# Altium project B101AA.PrjPcb (part 2 of 2)

## Sheet Shut Down Signal Control.SchDoc: Shut Down Signal Control
size 292 x 193 mm; SheetNumber: 7; SheetTotal: 15
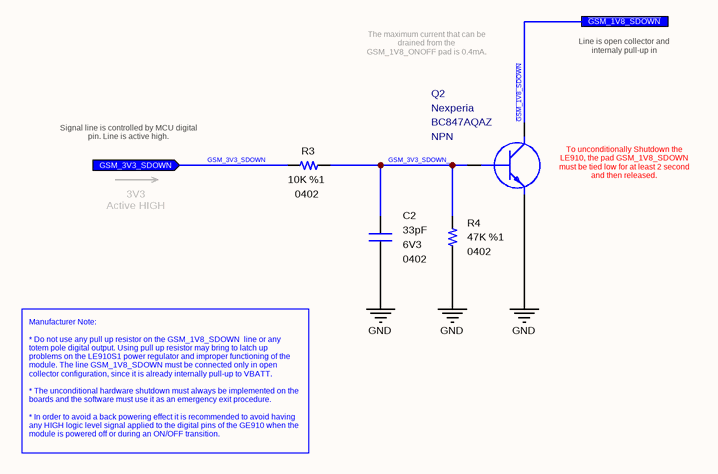
[diagram p13: Shut Down Signal Control.SchDoc]

### Parts
C2  value 33pF  Case: 0402  Voltage: 6V3  [CAPACITOR_0402]
Q2  Polarity: NPN  Manufacturer Part Number: BC847AQAZ  Manufacturer Name: Nexperia  [SOT1215]
R3  value 10K  Case: 0402  Tolerance: %1  [RESISTOR_0402]
R4  value 47K  Case: 0402  Tolerance: %1  [RESISTOR_0402]

### Ports
GSM_3V3_SDOWN (in), ~{GSM_1V8_SDOWN}

### Nets
GND: C2.1 Q2.2(E) R4.1
~{GSM_1V8_SDOWN}: Q2.3(C) ; port ~{GSM_1V8_SDOWN}
GSM_3V3_SDOWN: R3.2 ; port GSM_3V3_SDOWN
GSM_3V3_SDOWN_: C2.2 Q2.1(B) R3.1 R4.2

### Notes on the sheet
- The maximum current that can be drained from the GSM_1V8_ONOFF pad is 0.4mA.
- Line is open collector and internaly pull-up in LE910S1.
- Signal line is controlled by MCU digital pin. Line is active high.
- (near Q2) To unconditionally Shutdown the LE910, the pad GSM_1V8_SDOWN must be tied low for at least 2 second and then released.
- 3V3
  Active HIGH
- Manufacturer Note:
  * Do not use any pull up resistor on the GSM_1V8_SDOWN  line or any totem pole digital output. Using pull up resistor may bring to latch up problems on the LE910S1 power regulator and improper functioning of the module. The line GSM_1V8_SDOWN must be connected only in open collector configuration, since it is already internally pull-up to VBATT.
  * The unconditional hardware shutdown must always be implemented on the boards and the software must use it as an emergency exit procedure.
  * In order to avoid a back powering effect it is recommended to avoid having any HIGH logic level signal applied to the digital pins of the GE910 when the module is powered off or during an ON/OFF transition.
- © 2021 All rights reserved.
  This document may not, in whole or in part, be copied, photocopied, reproduced, translated or converted to any electronic or machine readable from without prior written permission of Mehmet Günce Akkoyun.
  Engineer contact : akkoyun@me.com
- Property of
- Engineer :
- Date :
- Size :
- A4
- Time :
- Project :
- Page :
- /
- Customer :
- Product ID :
- Module ID :
- Version :
- File :
- Revision :

### Library data of the parts
C2 = 33pF [0402-6V3]: Capacitor - 33pF [0402] (Ceramic); Manufacturer Part Number: C0402C330J9RACAUTO; Manufacturer Name: Kemet; Dielectric: X7R; Tolerance: 10%; Height: 0.5mm; Maximum Operating Temperature: +125; Minimum Operating Temperature: -55; ROHS: Yes; ComponentLink1Description: DataSheet; ComponentLink1URL: https://api.kemet.com/component-edge/download/datasheet/C0402C330J9RACAUTO.pdf; ComponentLink2Description: Mouser; ComponentLink2URL: https://www.mouser.com/Search/Refine.aspx?Keyword=80-C0402C330J9RAUTO
Q2 = BC847: Bipolar NPN Transistors; Case: DFN-1010D-3
R3 = 10K: Thick Film Resistors - SMD 1/16 W 10 Kohms 1%; Manufacturer Name: Vishay; Manufacturer Part Number: CRCW040210K0FKED; Height: 0.4mm; ComponentLink1Description: DataSheet; ComponentLink1URL: https://www.mouser.com.tr/datasheet/2/427/dcrcwe3-1762152.pdf; ComponentLink2Description: Mouser; ComponentLink2URL: https://www.mouser.com.tr/ProductDetail/Vishay-Dale/CRCW040210K0FKED?qs=sGAEpiMZZMu61qfTUdNhG2DpbjADlD3GcalbOv9utCY%3D
R4 = 47K: Thick Film Resistors - SMD 1/16 W 47 Kohms 1%; Manufacturer Name: Vishay; Manufacturer Part Number: CRCW040247K0FKED; ComponentLink1URL: https://www.mouser.com.tr/datasheet/2/427/dcrcwe3-1762152.pdf; ComponentLink1Description: DataSheet; Height: 0.4mm; ComponentLink2Description: Mouser; ComponentLink2URL: https://www.mouser.com.tr/ProductDetail/Vishay-Dale/CRCW040247K0FKED?qs=sGAEpiMZZMu61qfTUdNhG2DpbjADlD3GL%252B3h1elTxqU%3D

## Sheet GNSS EN Signal Control.SchDoc: On / Off Signal Control
size 292 x 193 mm; SheetNumber: 8; SheetTotal: 15
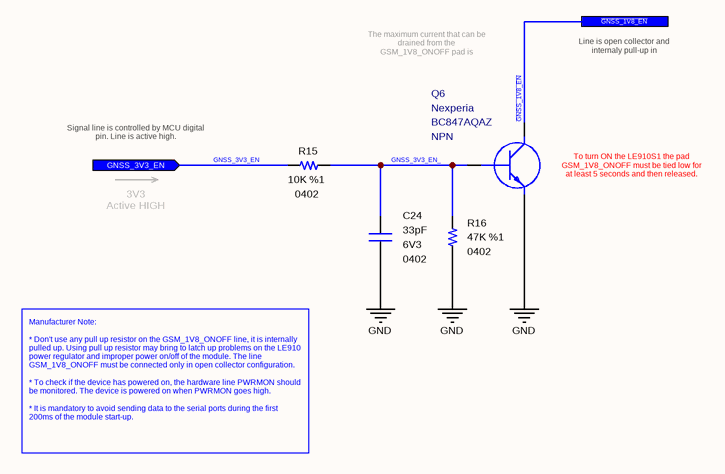
[diagram p14: GNSS EN Signal Control.SchDoc]

### Parts
C24  value 33pF  Case: 0402  Voltage: 6V3  [CAPACITOR_0402]
Q6  Polarity: NPN  Manufacturer Part Number: BC847AQAZ  Manufacturer Name: Nexperia  [SOT1215]
R15  value 10K  Case: 0402  Tolerance: %1  [RESISTOR_0402]
R16  value 47K  Case: 0402  Tolerance: %1  [RESISTOR_0402]

### Ports
GNSS_3V3_EN (in), ~{GNSS_1V8_EN}

### Nets
GND: C24.1 Q6.2(E) R16.1
~{GNSS_1V8_EN}: Q6.3(C) ; port ~{GNSS_1V8_EN}
GNSS_3V3_EN: R15.2 ; port GNSS_3V3_EN
GNSS_3V3_EN_: C24.2 Q6.1(B) R15.1 R16.2

### Notes on the sheet
- The maximum current that can be drained from the GSM_1V8_ONOFF pad is 0.12mA.
- Line is open collector and internaly pull-up in LE910S1.
- Signal line is controlled by MCU digital pin. Line is active high.
- (near Q6) To turn ON the LE910S1 the pad GSM_1V8_ONOFF must be tied low for at least 5 seconds and then released.
- 3V3
  Active HIGH
- Manufacturer Note:
  * Don't use any pull up resistor on the GSM_1V8_ONOFF line, it is internally pulled up. Using pull up resistor may bring to latch up problems on the LE910 power regulator and improper power on/off of the module. The line GSM_1V8_ONOFF must be connected only in open collector configuration.
  * To check if the device has powered on, the hardware line PWRMON should be monitored. The device is powered on when PWRMON goes high.
  * It is mandatory to avoid sending data to the serial ports during the first 200ms of the module start-up.
- © 2021 All rights reserved.
  This document may not, in whole or in part, be copied, photocopied, reproduced, translated or converted to any electronic or machine readable from without prior written permission of Mehmet Günce Akkoyun.
  Engineer contact : akkoyun@me.com
- Property of
- Engineer :
- Date :
- Size :
- A4
- Time :
- Project :
- Page :
- /
- Customer :
- Product ID :
- Module ID :
- Version :
- File :
- Revision :

### Library data of the parts
C24 = 33pF [0402-6V3]: as C2 on sheet Shut Down Signal Control; Height: 0.5mm; Maximum Operating Temperature: +125; Minimum Operating Temperature: -55; ROHS: Yes; ComponentLink1Description: DataSheet; ComponentLink1URL: https://api.kemet.com/component-edge/download/datasheet/C0402C330J9RACAUTO.pdf; ComponentLink2Description: Mouser; ComponentLink2URL: https://www.mouser.com/Search/Refine.aspx?Keyword=80-C0402C330J9RAUTO
Q6 = BC847: Bipolar NPN Transistors; Case: DFN-1010D-3
R15 = 10K: as R3 on sheet Shut Down Signal Control; Height: 0.4mm; ComponentLink1Description: DataSheet; ComponentLink1URL: https://www.mouser.com.tr/datasheet/2/427/dcrcwe3-1762152.pdf; ComponentLink2Description: Mouser; ComponentLink2URL: https://www.mouser.com.tr/ProductDetail/Vishay-Dale/CRCW040210K0FKED?qs=sGAEpiMZZMu61qfTUdNhG2DpbjADlD3GcalbOv9utCY%3D
R16 = 47K: as R4 on sheet Shut Down Signal Control; ComponentLink1URL: https://www.mouser.com.tr/datasheet/2/427/dcrcwe3-1762152.pdf; ComponentLink1Description: DataSheet; Height: 0.4mm; ComponentLink2Description: Mouser; ComponentLink2URL: https://www.mouser.com.tr/ProductDetail/Vishay-Dale/CRCW040247K0FKED?qs=sGAEpiMZZMu61qfTUdNhG2DpbjADlD3GL%252B3h1elTxqU%3D

## Nets that join several sheets
GND: Voltage Translator (23 pins), GSM Antenna (7 pins), GSM Stat LED Driver (5 pins), SIM Socket (14 pins), GNSS Antenna (C14.1 RF2.2 RF2.3 RF2.4), GSM Power Switch (8 pins), Card Edge Connector (12 pins), GNSS PPS LED Driver (5 pins), GSM Modem Power Feed (47 pins), On-Off Signal Control (C1.1 Q1.2 R2.1), Shut Down Signal Control (C2.1 Q2.2 R4.1), GNSS EN Signal Control (C24.1 Q6.2 R16.1)
VAUX: Voltage Translator (C30.2 U3.23 U3.24), GSM Modem Power Feed (C25.2 U1.E13)
VCC: Voltage Translator (6 pins), GSM Stat LED Driver (C10.2 D5.2), GNSS Antenna (Q4.3), GSM Power Switch (C15.2 U2.1), Card Edge Connector (6 pins), GNSS PPS LED Driver (C23.2 D6.2)
VIOT: GSM Power Switch (C19.2 C20.1 FB1.2 TP1.1), GSM Modem Power Feed (6 pins)
~{GNSS_1V8_EN}: Signal Control Block (U1.G14), GNSS EN Signal Control (Q6.3)
~{GSM_1V8_ONOFF}: Signal Control Block (U1.R12), On-Off Signal Control (Q1.3)
~{GSM_1V8_SDOWN}: Signal Control Block (U1.R13), Shut Down Signal Control (Q2.3)
~{GSM_3V3_COMM_EN}: Voltage Translator (C31.2 R18.1 U3.22), Card Edge Connector (J1.14)
GNSS_3V3_EN: Card Edge Connector (J1.36), GNSS EN Signal Control (R15.2)
GNSS_3V3_RX: Voltage Translator (C36.2 U3.7), Card Edge Connector (J1.20)
GSM_3V3_ONOFF: Card Edge Connector (J1.32), On-Off Signal Control (R1.2)
GSM_3V3_PMON: Voltage Translator (C32.2 R19.2 U3.3), Card Edge Connector (J1.26)
GSM_3V3_RING: Voltage Translator (C34.2 R21.2 U3.5), Card Edge Connector (J1.30)
GSM_3V3_SDOWN: Card Edge Connector (J1.34), Shut Down Signal Control (R3.2)
GSM_3V3_SWREADY: Voltage Translator (C33.2 R20.2 U3.4), Card Edge Connector (J1.28)
GSM_3V3_TX: Voltage Translator (C35.2 U3.6), Card Edge Connector (J1.22)
IOT_POWER_EN: GSM Power Switch (C16.2 R11.2 U2.3), Card Edge Connector (J1.12)

## Assembly variants
B101AB: not fitted C8 C9 C10 C11 C12 C21 C22 C23 C27 C28 D1 D2 D3 D4 D5 D6 D7 L1 L2 Q3 Q5 Q7 R5 R6 R7 R12 R13 R14 R17